# Altium schematic sheet Signal_and_supply.SchDoc
size A4; SheetNumber: 2; SheetTotal: 2
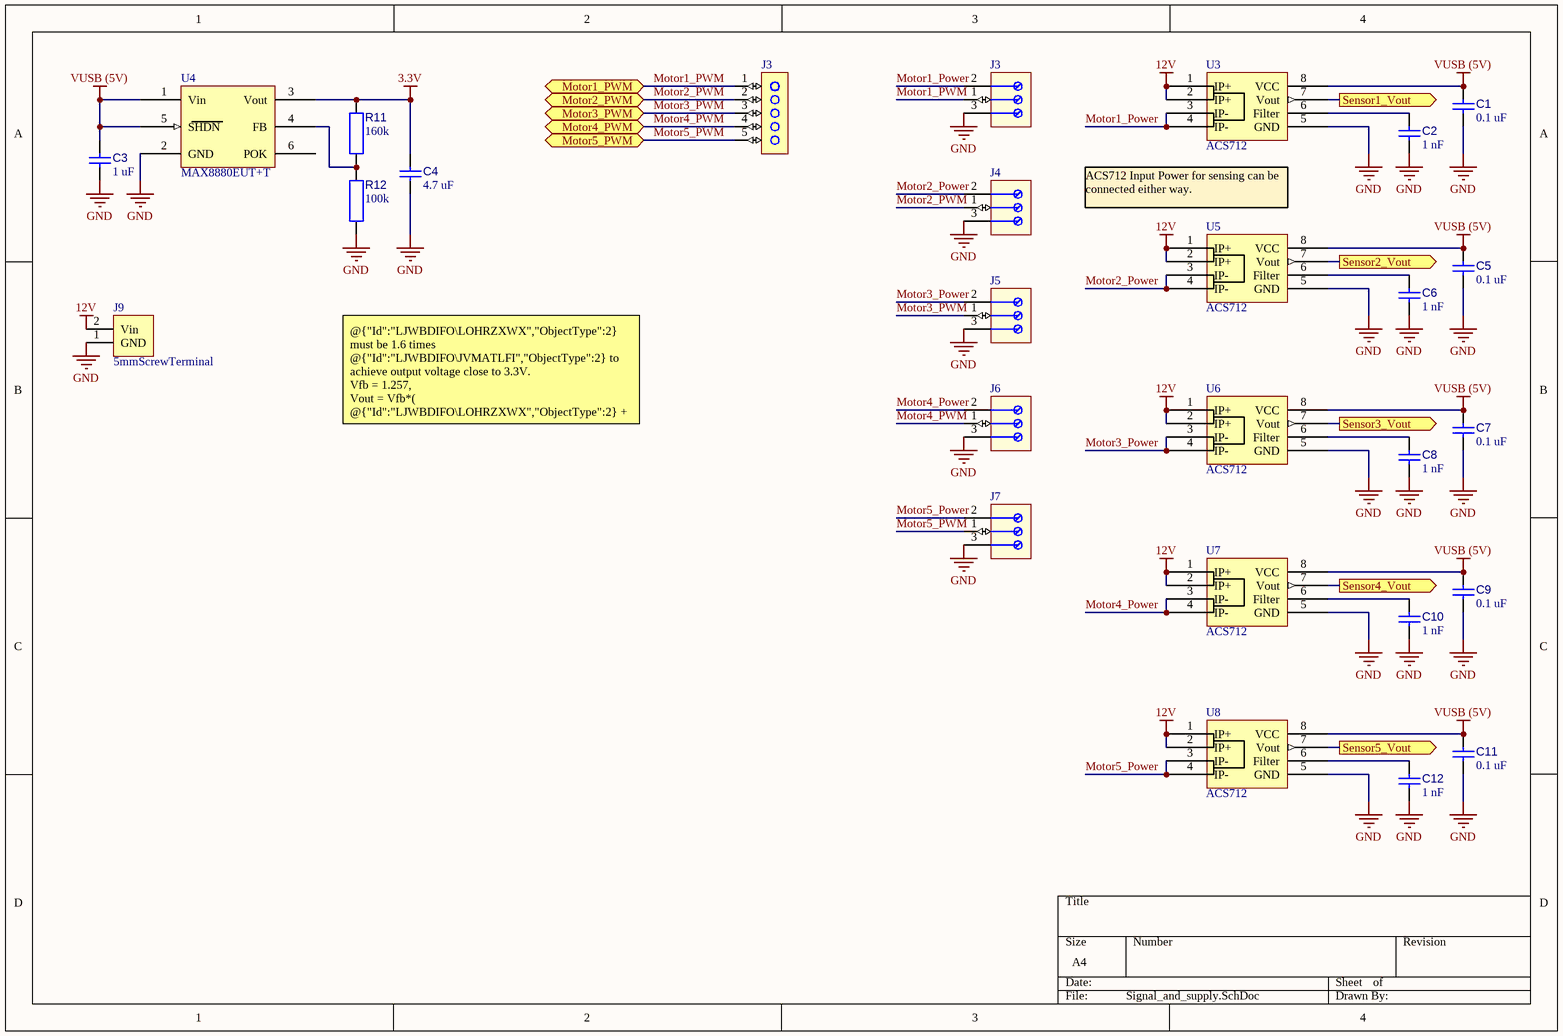
[diagram p0: Signal_and_supply.SchDoc]

## Parts
(Parts that share a designator on the sheet are numbered #1, #2 ... from top to bottom, then left to right.)
C1  Capacitance: 0.1 uF  [CAPC1608X08N]  (hidden comment: Capacitor 0603 generic)
C2  Capacitance: 1 nF  [CAPC1608X08N]  (hidden comment: Capacitor 0603 generic)
C3  Capacitance: 1 uF  [CAPC1608X08N]  (hidden comment: Capacitor 0603 generic)
C4  Capacitance: 4.7 uF  [CAPC1608X08N]  (hidden comment: Capacitor 0603 generic)
C5  Capacitance: 0.1 uF  [CAPC1608X08N]  (hidden comment: Capacitor 0603 generic)
C6  Capacitance: 1 nF  [CAPC1608X08N]  (hidden comment: Capacitor 0603 generic)
C7  Capacitance: 0.1 uF  [CAPC1608X08N]  (hidden comment: Capacitor 0603 generic)
C8  Capacitance: 1 nF  [CAPC1608X08N]  (hidden comment: Capacitor 0603 generic)
C9  Capacitance: 0.1 uF  [CAPC1608X08N]  (hidden comment: Capacitor 0603 generic)
C10  Capacitance: 1 nF  [CAPC1608X08N]  (hidden comment: Capacitor 0603 generic)
C11  Capacitance: 0.1 uF  [CAPC1608X08N]  (hidden comment: Capacitor 0603 generic)
C12  Capacitance: 1 nF  [CAPC1608X08N]  (hidden comment: Capacitor 0603 generic)
J3#1  691103110003  [691103110003]  (value not drawn)
J3#2  Header-2.54-ZL201-05G  [Header-2.54-ZL201-05G-Footprint-1]  (value not drawn)
J4  691103110003  [691103110003]  (value not drawn)
J5  691103110003  [691103110003]  (value not drawn)
J6  691103110003  [691103110003]  (value not drawn)
J7  691103110003  [691103110003]  (value not drawn)
J9  5mmScrewTerminal  [5mmScrewTerminal-Footprint-1]
R11  Resistance: 160k  [RESC1608X04N]  (hidden comment: Resistor 0603 generic)
R12  Resistance: 100k  [RESC1608X04N]  (hidden comment: Resistor 0603 generic)
U3  ACS712  [SOIC127P600X175-8N]
U4  MAX8880EUT+T  [SOT95P280X145-6N]
U5  ACS712  [SOIC127P600X175-8N]
U6  ACS712  [SOIC127P600X175-8N]
U7  ACS712  [SOIC127P600X175-8N]
U8  ACS712  [SOIC127P600X175-8N]

## Ports
Motor1_PWM (bidir, see MCU[2B]), Motor2_PWM (bidir, see MCU[2B]), Motor3_PWM (bidir, see MCU[2B]), Motor4_PWM (bidir, see MCU[2A]), Motor5_PWM (bidir, see MCU[2A]), Sensor1_Vout (out, see MCU[1A]), Sensor2_Vout (out, see MCU[1A]), Sensor3_Vout (out, see MCU[1A]), Sensor4_Vout (out, see MCU[1A]), Sensor5_Vout (out, see MCU[1A])

## Nets
3.3V: C4.1 R11.1 U4.3(Vout)
12V: J9.2(Vin) U3.1(IP+) U3.2(IP+) U5.1(IP+) U5.2(IP+) U6.1(IP+) U6.2(IP+) U7.1(IP+) U7.2(IP+) U8.1(IP+) U8.2(IP+)
GND: C1.2 C2.2 C3.1 C4.2 C5.2 C6.2 C7.2 C8.2 C9.2 C10.2 C11.2 C12.2 J3#1.3(GND) J4.3(GND) J5.3(GND) J6.3(GND) J7.3(GND) J9.1(GND) R12.2 U3.5(GND) U4.2(GND) U5.5(GND) U6.5(GND) U7.5(GND) U8.5(GND)
VUSB (5V): C1.1 C3.2 C5.1 C7.1 C9.1 C11.1 U3.8(VCC) U4.1(Vin) U4.5(SHDN) U5.8(VCC) U6.8(VCC) U7.8(VCC) U8.8(VCC)
Motor1_Power: J3#1.2(V+) U3.3(IP-) U3.4(IP-)
Motor1_PWM: J3#1.1(PWM) J3#2.1 ; port Motor1_PWM
Motor2_Power: J4.2(V+) U5.3(IP-) U5.4(IP-)
Motor2_PWM: J3#2.2 J4.1(PWM) ; port Motor2_PWM
Motor3_Power: J5.2(V+) U6.3(IP-) U6.4(IP-)
Motor3_PWM: J3#2.3 J5.1(PWM) ; port Motor3_PWM
Motor4_Power: J6.2(V+) U7.3(IP-) U7.4(IP-)
Motor4_PWM: J3#2.4 J6.1(PWM) ; port Motor4_PWM
Motor5_Power: J7.2(V+) U8.3(IP-) U8.4(IP-)
Motor5_PWM: J3#2.5 J7.1(PWM) ; port Motor5_PWM
Sensor1_Vout: U3.7(Vout) ; port Sensor1_Vout
Sensor2_Vout: U5.7(Vout) ; port Sensor2_Vout
Sensor3_Vout: U6.7(Vout) ; port Sensor3_Vout
Sensor4_Vout: U7.7(Vout) ; port Sensor4_Vout
Sensor5_Vout: U8.7(Vout) ; port Sensor5_Vout
NetC2_1: C2.1 U3.6(Filter)
NetC6_1: C6.1 U5.6(Filter)
NetC8_1: C8.1 U6.6(Filter)
NetC10_1: C10.1 U7.6(Filter)
NetC12_1: C12.1 U8.6(Filter)
NetR11_2: R11.2 R12.1 U4.4(FB)

Not connected (* = marked no-connect by the designer): U4 6(POK)

## Notes on the sheet
- ACS712 Input Power for sensing can be connected either way.
- @{"Id":"LJWBDIFO\LOHRZXWX","ObjectType":2} must be 1.6 times @{"Id":"LJWBDIFO\JVMATLFI","ObjectType":2} to achieve output voltage close to 3.3V.
  Vfb = 1.257,
  Vout = Vfb*( @{"Id":"LJWBDIFO\LOHRZXWX","ObjectType":2} + @{"Id":"LJWBDIFO\JVMATLFI","ObjectType":2} )/ @{"Id":"LJWBDIFO\JVMATLFI","ObjectType":2} = 3.268 V.
  Settin @{"Id":"LJWBDIFO\JVMATLFI","ObjectType":2} to 1 megaohm  and calculating @{"Id":"LJWBDIFO\LOHRZXWX","ObjectType":2} would result in marginally less current consumption.

## Library data of the parts
C1-C12 = CMP-001-00083-2: Generic 0603 capacitor. No set voltage/capacitance rating.
J3#1 J4-J7 = CMP-00028-00008-2: Barrier Strip Terminal Block; RoHS Compliant: Yes
J3#2 = CMP-00028-00007-3: Male header, pitch 2.54 mm, 1x5 pins
J9 = CMP-00028-00010-3: 16A 5 mm pitch screw terminal, 2 sockets.
R11 R12 = CMP-009-00177-2: Generic 0603 resistor, no fixed value.
U3 U5-U8 = CMP-010-00024-2: Integrated, Hall-Effect-Based Linear Current Sensor IC; Nominal Supply Current: 10mA; Max Supply Voltage: 8V; Output Current: 3mA; Min Supply Voltage: 4.5V; Nominal Supply Voltage: 5V; Sensor Type: analog current sensor; ComponentLink1URL: https://www.farnell.com/datasheets/3283075.pdf?_gl=1*655fm5*_gcl_aw*R0NMLjE3MjkyNjA3NzYuQ2p3S0NBandqc2k0QmhCNUVpd0FGQUwwWUJJQ1IwTktsZUpReWIxcFRubGxNLVh3bUhQcFctSFhLUnYtVFFUc01qMmhGYkt5YWJZdmpob0N3c0lRQXZEX0J3RQ..*_gcl_au*MTA1Mjg3ODU0LjE3Mjc3MDI1ODg.; Max Operating Temperature: 85°C; Mounting Technology: smd; Min Operating Temperature: -40°C; RoHS Compliant: yes; Pins: 8; ComponentLink1Description: Datasheet; Case/Package: SOIC8
U4 = CMP-019-00049-1: Ultra-Low-IQ, Low-Dropout Linear Regulator, output 1.25 - 5.5 V.; Max Supply Voltage: 12V; Nominal Supply Current: 3mA; Output Current: 200mA; Output Voltage: 3.3V; Min Supply Voltage: 2.5V; Dropout Voltage: 100mV; Pins: 6; Case/Package: SOT-6; Mounting Technology: smd; Min Operating Temperature: -40°C; RoHS Compliant: yes; Max Operating Temperature: 125°C